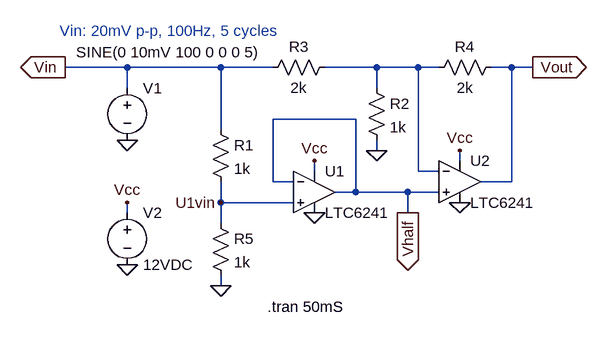
[diagram p0: schematic Diodeless_Precision_Rectifier_1.asc]
Diodeless_Precision_Rectifier_1.asc, the LTspice schematic file:
Version 4
SHEET 1 880 680
WIRE -320 96 -416 96
WIRE -176 96 -320 96
WIRE -96 96 -176 96
WIRE 64 96 -16 96
WIRE 128 96 64 96
WIRE 160 96 128 96
WIRE 272 96 240 96
WIRE 304 96 272 96
WIRE -320 128 -320 96
WIRE 64 128 64 96
WIRE 32 176 -96 176
WIRE -176 192 -176 96
WIRE 64 224 64 208
WIRE 192 240 192 224
WIRE -32 256 -32 240
WIRE 128 256 128 96
WIRE 160 256 128 256
WIRE -96 272 -96 176
WIRE -64 272 -96 272
WIRE 272 272 272 96
WIRE 272 272 224 272
WIRE 32 288 32 176
WIRE 32 288 0 288
WIRE 112 288 32 288
WIRE 160 288 112 288
WIRE -176 304 -176 272
WIRE -64 304 -176 304
WIRE -320 320 -320 304
WIRE 112 320 112 288
WIRE -176 336 -176 304
WIRE -176 432 -176 416
FLAG 64 224 0
FLAG -176 432 0
FLAG -320 208 0
FLAG -320 400 0
FLAG -320 304 Vcc
FLAG 304 96 Vout
IOPIN 304 96 Out
FLAG -416 96 Vin
IOPIN -416 96 Out
FLAG 192 304 0
FLAG -32 320 0
FLAG 192 224 Vcc
FLAG -32 240 Vcc
FLAG 112 320 Vhalf
IOPIN 112 320 Out
FLAG -176 304 U1vin
SYMBOL res -192 176 R0
SYMATTR InstName R1
SYMATTR Value 1k
SYMBOL res -192 320 R0
SYMATTR InstName R5
SYMATTR Value 1k
SYMBOL res 48 112 R0
SYMATTR InstName R2
SYMATTR Value 1k
SYMBOL res -112 112 R270
WINDOW 0 32 56 VTop 0
WINDOW 3 0 56 VBottom 0
SYMATTR InstName R3
SYMATTR Value 2k
SYMBOL res 144 112 R270
WINDOW 0 32 56 VTop 0
WINDOW 3 0 56 VBottom 0
SYMATTR InstName R4
SYMATTR Value 2k
SYMBOL voltage -320 112 R0
WINDOW 3 -79 -39 Left 0
WINDOW 123 0 0 Left 0
WINDOW 39 0 0 Left 0
SYMATTR InstName V1
SYMATTR Value SINE(0 10mV 100 0 0 0 5)
SYMBOL voltage -320 304 R0
WINDOW 123 0 0 Left 0
WINDOW 39 0 0 Left 0
SYMATTR InstName V2
SYMATTR Value 12VDC
SYMBOL Opamps\\LTC6241 -32 288 R0
SYMATTR InstName U1
SYMBOL Opamps\\LTC6241 192 272 R0
SYMATTR InstName U2
TEXT -104 464 Left 0 !.tran 50mS
TEXT -424 40 Left 0 ;Vin: 20mV p-p, 100Hz, 5 cycles

The netlist it stands for:
* Diodeless_Precision_Rectifier_1.asc
R1 Vin U1vin 1k
R5 U1vin 0 1k
R2 N001 0 1k
R3 Vin N001 2k
R4 N001 Vout 2k
V1 Vin 0 SINE(0 10mV 100 0 0 0 5)
V2 Vcc 0 12VDC
XU1 U1vin Vhalf Vcc 0 Vhalf LTC6241  ; pins In+ In- V+ V- OUT
XU2 Vhalf N001 Vcc 0 Vout LTC6241  ; pins In+ In- V+ V- OUT
.tran 50mS
* Vin: 20mV p-p, 100Hz, 5 cycles
.lib LTC4.lib
.backanno
.end